# EasyEDA Pro project ZIAD_DBW_PROJECT_EDIT_9_MAY_2025.epro, board SteeringBoard4.4
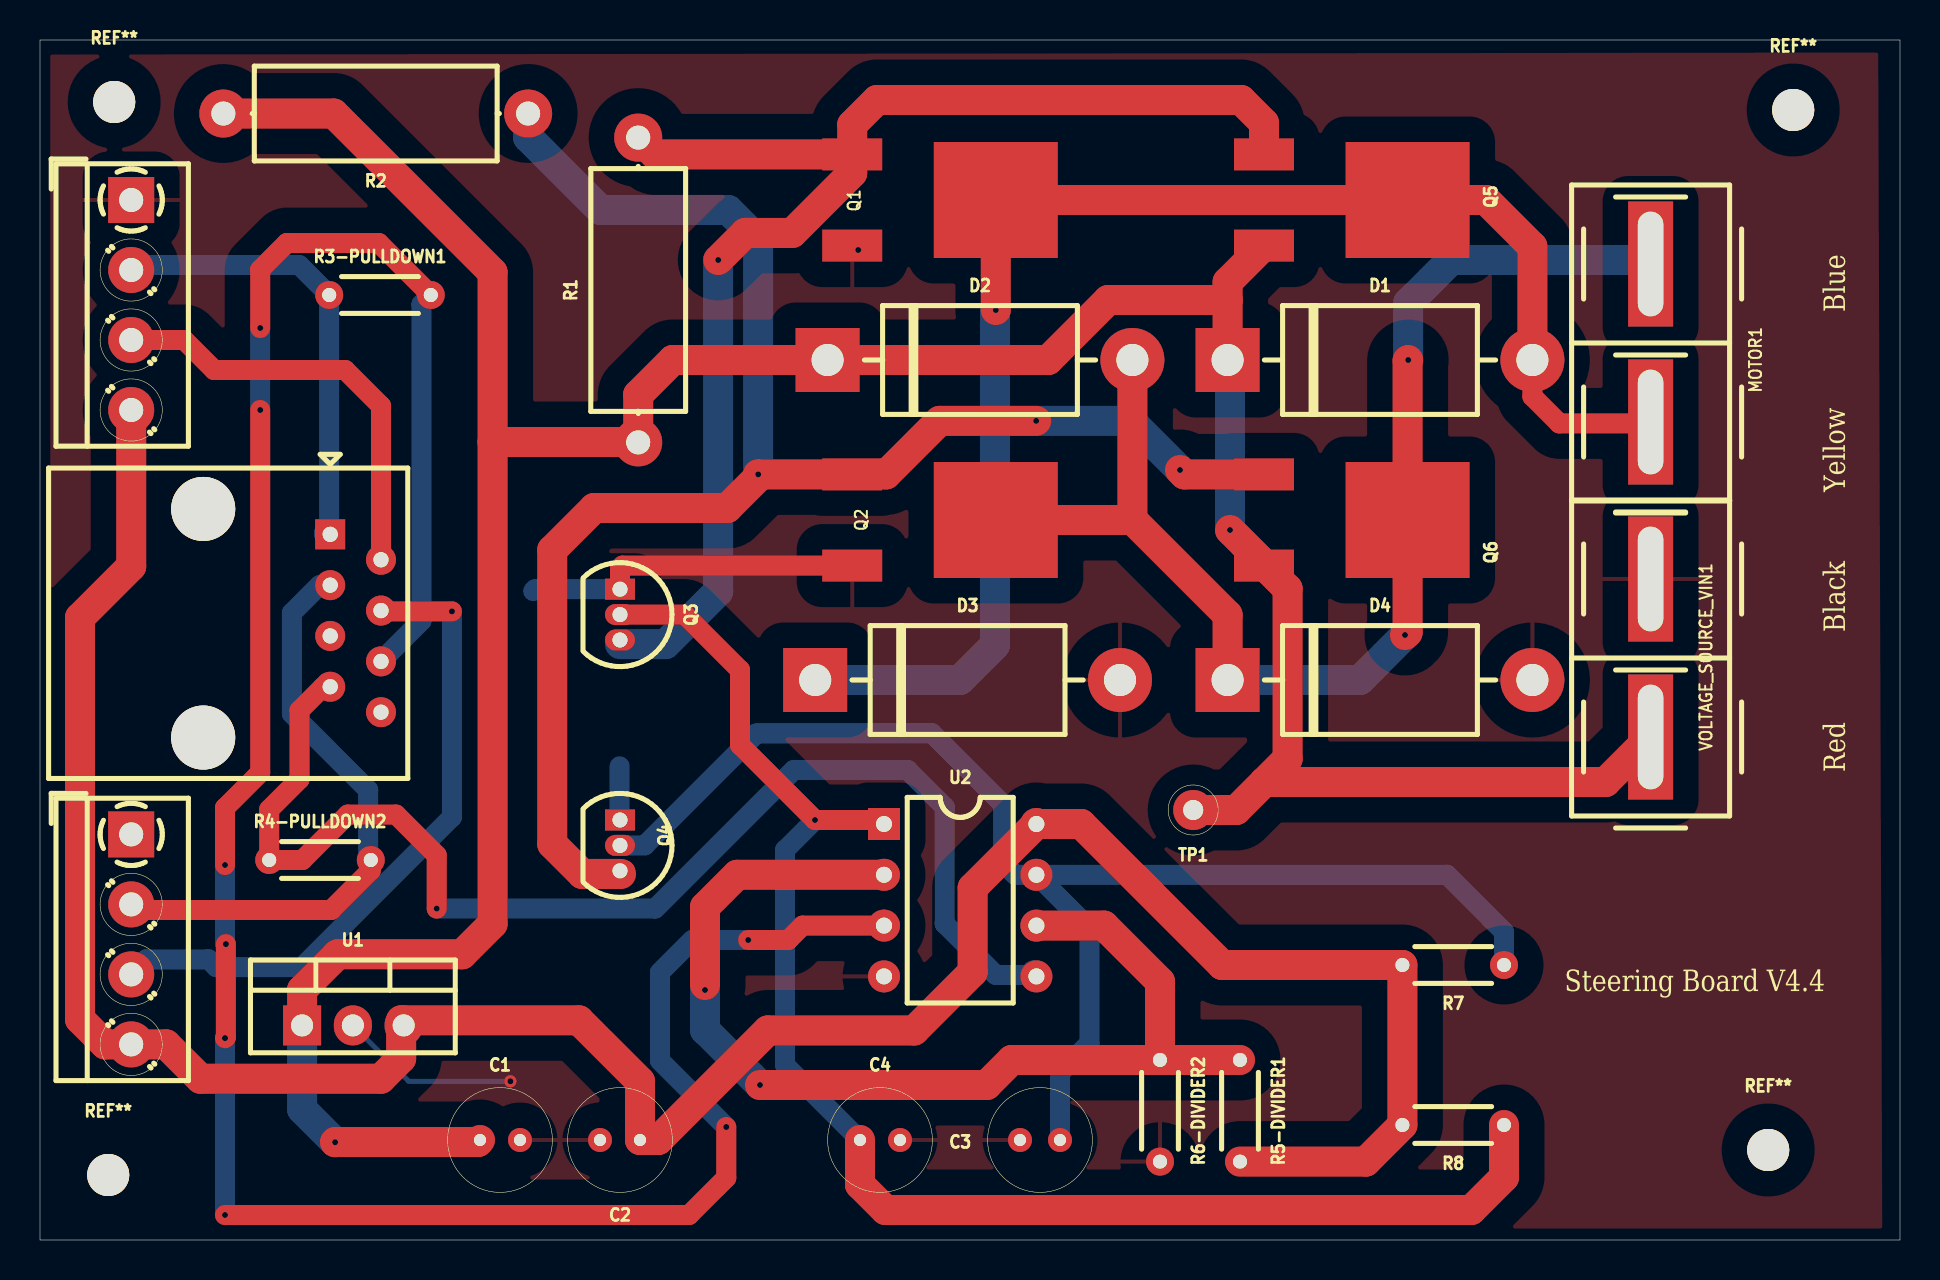
[diagram p9: board, top side]
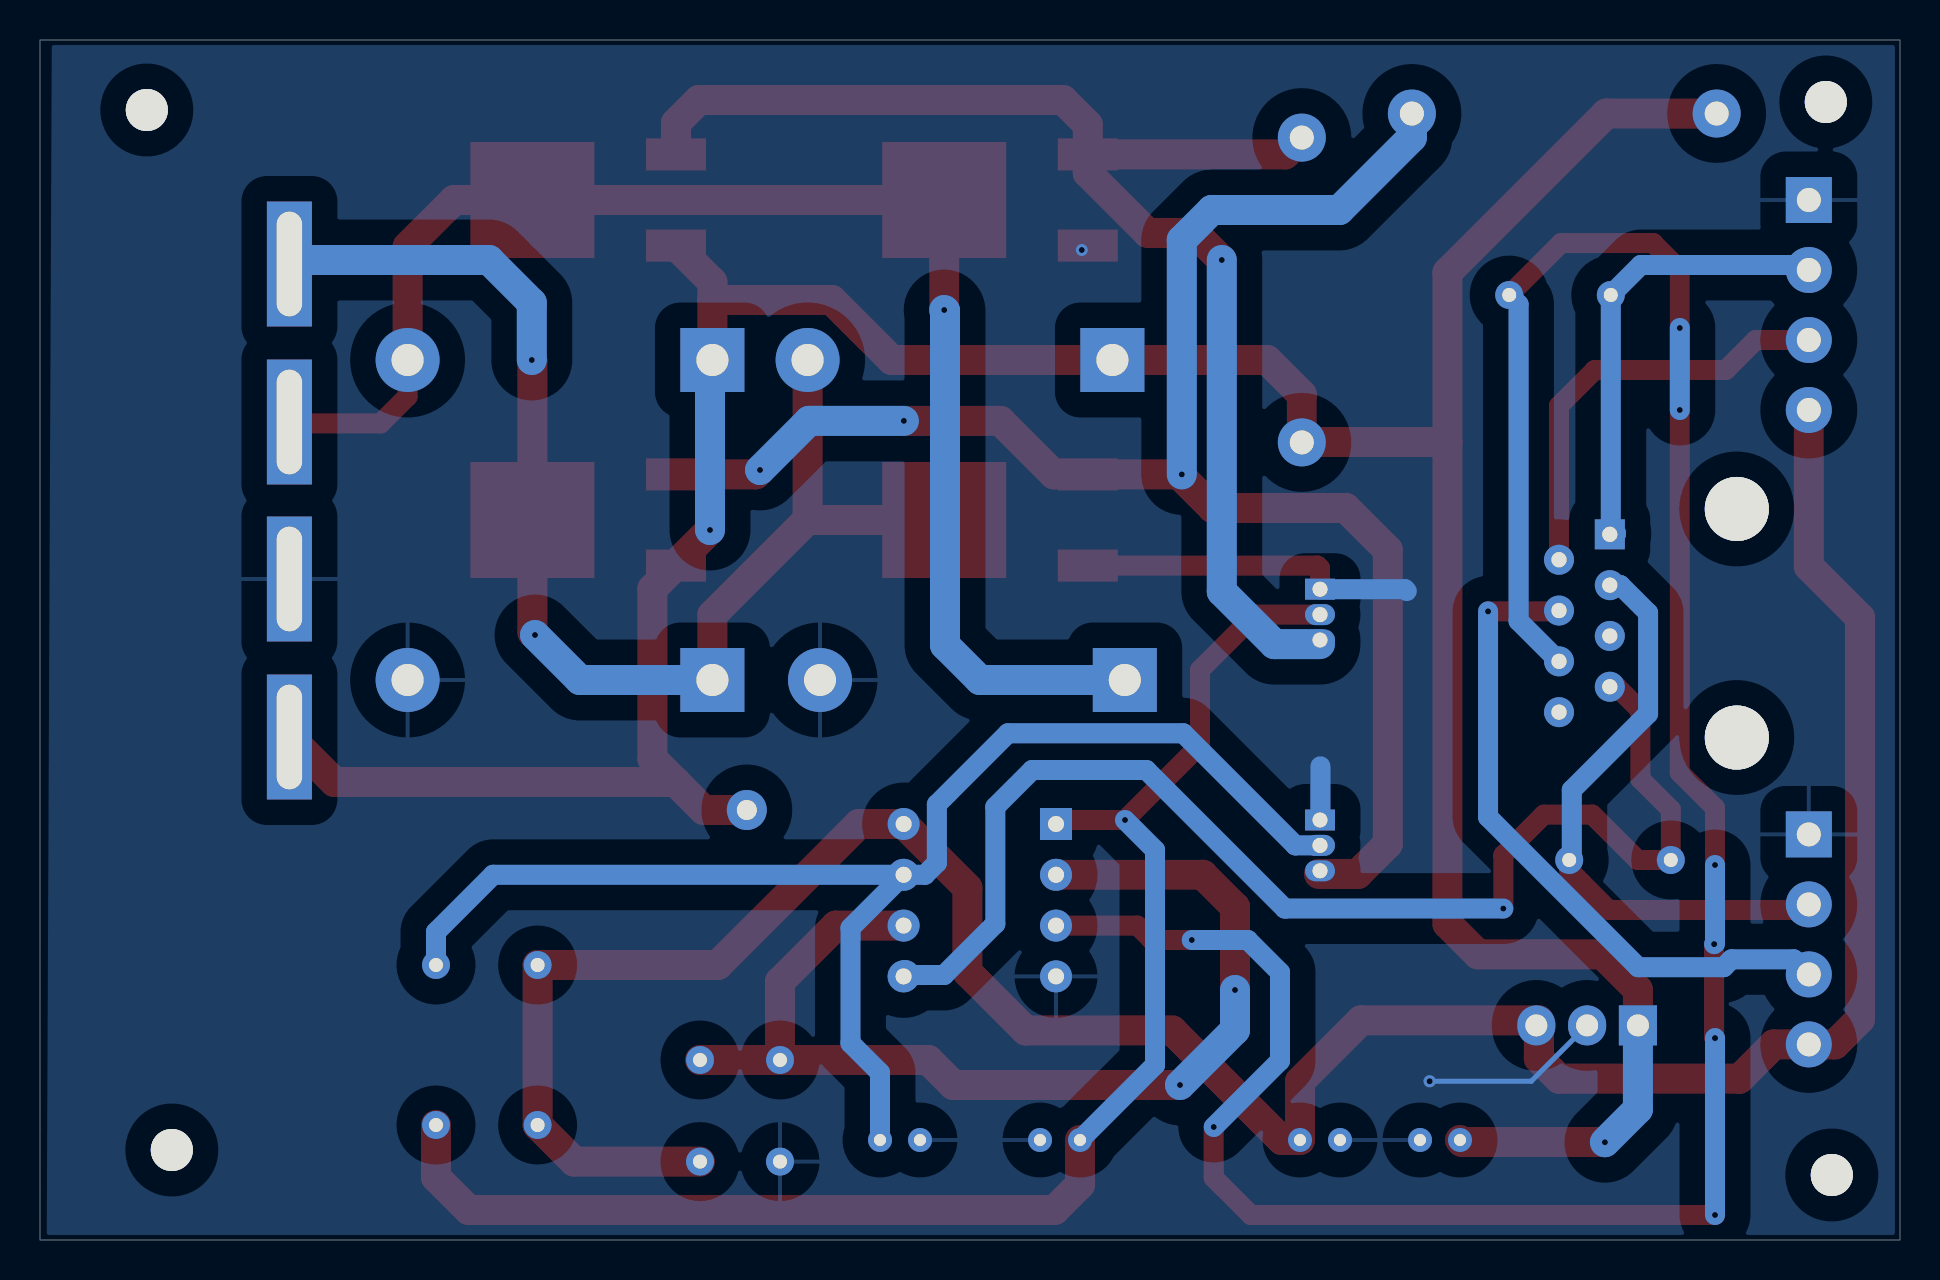
[diagram p10: board, bottom side, seen from below]

Outline 93 x 60 mm; copper layers: Top Layer, Bottom Layer. Coordinates in mm from the lower left corner of the outline.
Outline path: 0,60 93,60 93,0 0,0 0,60
Stack: Top Layer 0.035mm / Dielectric1 1.51mm FR4 er 4.5 / Bottom Layer 0.035mm

## Design rules (mm)
spacing safeClearance (default): track to track 0.152, other pairs 0.152 to 0.3
track width trackWidth (default): min 0.127, default 0.254, max 2.54
differential pair differentialPair (default): width min 0.127, default 0.254, max 2.54; gap min 0.152, default 0.152
via viaSize (default): diameter min 0.5, default 0.61, max 10; hole min 0.3, default 0.305, max 6
net GND uses CopperRegion1
pour ie568 uses CopperRegion1
pour ie567 uses CopperRegion1

## Placement (name value [footprint] x y rotation side)
C1  0.33uF  [Capacitor_THT:C_Radial_D5.0mm_H7.0mm_P2.00mm]  22 5 0 top
C2  0.1uF  [Capacitor_THT:C_Radial_D5.0mm_H7.0mm_P2.00mm]  30 5 180 top
C3  10pF  [Capacitor_THT:C_Radial_D5.0mm_H7.0mm_P2.00mm]  51 5 180 top
C4  10pF  [Capacitor_THT:C_Radial_D5.0mm_H7.0mm_P2.00mm]  41 5 0 top
D1  SB5H100-E3/73  [Diode_THT:D_DO-201AD_P15.24mm_Horizontal]  59.38 44 0 top
D2  SB5H100-E3/73  [Diode_THT:D_DO-201AD_P15.24mm_Horizontal]  39.38 44 0 top
D3  SB5H100-E3/73  [Diode_THT:D_DO-201AD_P15.24mm_Horizontal]  38.76 28 0 top
D4  SB5H100-E3/73  [Diode_THT:D_DO-201AD_P15.24mm_Horizontal]  59.38 28 0 top
LEFT1  Screw_Terminal_01x04  [TerminalBlock_MetzConnect:TerminalBlock_MetzConnect_Type059_RT06304HBWC_1x04_P3.50mm_Horizontal]  4.56 52 270 top
MOTOR1  Conn_01x02  [Anderson_Connector:Anderson_Conn]  86.74 44.85 90 top
Q1  AOD66406  [AOD66406:AOD66406]  39.92 52 270 top
Q2  AOD66406  [AOD66406:AOD66406]  39.92 36 270 top
Q3  2N7000  [Package_TO_SOT_THT:TO-92_Inline]  29 32.54 270 top
Q4  2N7000  [Package_TO_SOT_THT:TO-92_Inline]  29 21 270 top
Q5  AOD4189  [AOD4189:DPACK]  66 52 270 top
Q6  AOD4189  [AOD4189:DPACK]  66 36 270 top
R1  1K  [Resistor_THT:R_Axial_DIN0414_L11.9mm_D4.5mm_P15.24mm_Horizontal]  29.91 39.88 90 top
R2  1K  [Resistor_THT:R_Axial_DIN0414_L11.9mm_D4.5mm_P15.24mm_Horizontal]  24.41 56.32 180 top
R3-PULLDOWN1  10K  [Resistor_THT:R_Axial_DIN0204_L3.6mm_D1.6mm_P5.08mm_Horizontal]  14.46 47.25 0 top
R4-PULLDOWN2  10K  [Resistor_THT:R_Axial_DIN0204_L3.6mm_D1.6mm_P5.08mm_Horizontal]  11.46 19 0 top
R5-DIVIDER1  10K  [Resistor_THT:R_Axial_DIN0204_L3.6mm_D1.6mm_P5.08mm_Horizontal]  60 9 270 top
R6-DIVIDER2  4.7K  [Resistor_THT:R_Axial_DIN0204_L3.6mm_D1.6mm_P5.08mm_Horizontal]  56 9 270 top
R7  10k  [Resistor_THT:R_Axial_DIN0204_L3.6mm_D1.6mm_P5.08mm_Horizontal]  73.2 13.75 180 top
R8  10k  [Resistor_THT:R_Axial_DIN0204_L3.6mm_D1.6mm_P5.08mm_Horizontal]  73.2 5.75 180 top
REF**  -  [MountingHole:MountingHole_2.1mm]  3.41 3.25 0 top
REF**#2  -  [MountingHole:MountingHole_2.1mm]  3.71 56.9 0 top
REF**#3  -  [MountingHole:MountingHole_2.1mm]  87.66 56.5 0 top
REF**#4  -  [MountingHole:MountingHole_2.1mm]  86.41 4.5 0 top
RIGHT1  Screw_Terminal_01x04  [TerminalBlock_MetzConnect:TerminalBlock_MetzConnect_Type059_RT06304HBWC_1x04_P3.50mm_Horizontal]  4.56 20.28 270 top
RJ1  RJ45  [Connector_RJ:RJ45_Amphenol_54602-x08_Horizontal]  14.51 35.28 270 top
TP1  TestPoint  [Connector_Pin:Pin_D1.0mm_L10.0mm]  57.66 21.5 0 top
U1  L7805  [Package_TO_SOT_THT:TO-220-3_Vertical]  13.1 10.73 0 top
U2  LM393N  [Package_DIP:DIP-8_W7.62mm]  42.2 20.8 0 top
VOLTAGE_SOURCE_VIN1  Conn_01x02  [Anderson_Connector:Anderson_Conn]  86.74 29.1 90 top

## Footprints (pads in the part's own frame, mm; a bottom-side part is the same pattern mirrored in y, then rotated)
Anderson_Connector:Anderson_Conn
  rect 6.25x2.25 hole 5.23x1.27: 1(-3.95,6.21) 2(3.95,6.21)
AOD4189:DPACK
  rect 1.6x3 smd: 1(-2.28,-4.8) 3(2.28,-4.8)
  rect 5.8x6.2 smd: 4(0,2.38)
AOD66406:AOD66406
  rect 5.8x6.2 smd: 1(0,7.87)
  rect 1.6x3 smd: 2(-2.28,0.69) 3(2.28,0.69)
Capacitor_THT:C_Radial_D5.0mm_H7.0mm_P2.00mm
  round 1.2 hole 0.6: 1(0,0) 2(2,0)
Connector_Pin:Pin_D1.0mm_L10.0mm
  round 2 hole 1: 1(0,0)
Connector_RJ:RJ45_Amphenol_54602-x08_Horizontal
  rect 1.5x1.5 hole 0.76: 1(0,0)
  round 1.5 hole 0.76: 2(1.27,2.54) 3(2.54,0) 4(3.81,2.54) 5(5.08,0) 6(6.35,2.54) 7(7.62,0) 8(8.89,2.54)
  round 3.2 hole 3.2: 9(10.16,-6.35) 10(-1.27,-6.35)
Diode_THT:D_DO-201AD_P15.24mm_Horizontal
  rect 3.2x3.2 hole 1.6: 1(0,0)
  round 3.2 hole 1.6: 2(15.24,0)
MountingHole:MountingHole_2.1mm
  round 2.1 hole 2.1: 1(0,0)
Package_DIP:DIP-8_W7.62mm
  rect 1.6x1.6 hole 0.8: 1(0,0)
  round 1.6 hole 0.8: 2(0,-2.54) 3(0,-5.08) 4(0,-7.62) 5(7.62,-7.62) 6(7.62,-5.08) 7(7.62,-2.54) 8(7.62,0)
Package_TO_SOT_THT:TO-92_Inline
  rect 1.05x1.5 hole 0.75: 1(0,0)
  oval 1.05x1.5 hole 0.75: 2(1.27,0) 3(2.54,0)
Package_TO_SOT_THT:TO-220-3_Vertical
  rect 1.905x2 hole 1.1: 1(0,0)
  oval 1.905x2 hole 1.1: 2(2.54,0) 3(5.08,0)
Resistor_THT:R_Axial_DIN0204_L3.6mm_D1.6mm_P5.08mm_Horizontal
  round 1.4 hole 0.7: 1(0,0) 2(5.08,0)
Resistor_THT:R_Axial_DIN0414_L11.9mm_D4.5mm_P15.24mm_Horizontal
  round 2.4 hole 1.2: 1(0,0) 2(15.24,0)
TerminalBlock_MetzConnect:TerminalBlock_MetzConnect_Type059_RT06304HBWC_1x04_P3.50mm_Horizontal
  rect 2.3x2.3 hole 1.2: 1(0,0)
  round 2.3 hole 1.2: 2(3.5,0) 3(7,0) 4(10.5,0)

## Nets
GND: C1.2 C2.2 C3.2 C4.2 D3.2 D4.2 LEFT1.1 Q1.3 Q2.3 Q3.1 Q4.1 R6-DIVIDER2.2 RIGHT1.1 U1.2 U2.4 VOLTAGE_SOURCE_VIN1.2
1.8 VDC: R5-DIVIDER1.1 R6-DIVIDER2.1 U2.2 U2.6
5 VDC: C2.1 LEFT1.4 R5-DIVIDER1.2 R7.2 R8.2 RIGHT1.4 U1.3 U2.8
/L_RTN: LEFT1.2 R3-PULLDOWN1.1 RJ1.1
/L_SENSE: LEFT1.3 RJ1.2
/R_RTN: R4-PULLDOWN2.2 RIGHT1.2 RJ1.3
/R_SENSE: RIGHT1.3 RJ1.4
/R_TN: R3-PULLDOWN1.2 RJ1.6 U2.3
L_TN: R4-PULLDOWN2.1 RJ1.7 U2.5
LOAD_LEFT: D1.2 D3.1 MOTOR1.1 Q1.1 Q5.4
LOAD_RIGHT: D2.2 D4.1 MOTOR1.2 Q2.1 Q6.4
NET-(Q1-G): Q1.2 Q3.3 Q5.1 R1.2
NET-(Q2-G): Q2.2 Q4.3 Q6.1 R2.1
NET-(Q3-G): C4.1 Q3.2 R8.1 U2.1
NET-(Q4-G): C3.1 Q4.2 R7.1 U2.7
UNCONNECTED-(RJ1-PAD5): RJ1.5
UNCONNECTED-(RJ1-PAD8): RJ1.8
V_{SUPPLY}: C1.1 D1.1 D2.1 Q5.3 Q6.3 R1.1 R2.2 TP1.1 U1.1 VOLTAGE_SOURCE_VIN1.1

Pads without a net: REF** 1; REF**#2 1; REF**#3 1; REF**#4 1; RJ1 9 10

## Via types
v1: diameter 0.61, hole 0.305, Top Layer to Bottom Layer, 4 vias
v2: diameter 0.6, hole 0.3, Top Layer to Bottom Layer, 20 vias

## Routing (per net, layer and track width the routed paths; a pad name or vN(x,y) marks a point on that pad's centre or on a via; arc(x,y) is an arc through that point)
GND: length 28.8
  Top Layer w1: Q2.3 29.13,33.72 29,33.59 Q3.1
  Bottom Layer w0.254: U1.2 18.44,7.94 v1(23.52,7.94) ; 28.98,21.02 Q4.1
  Bottom Layer w1: 28.98,23.68 28.98,21.02 ; 24.66,32.45 24.75,32.54 Q3.1
  vias: v2(40.91,49.5)
1.8 VDC: length 55.2
  Top Layer w1.5: U2.2 34.86,18.26 33.25,16.65 33.25,12.75 ; R6-DIVIDER2.1 R5-DIVIDER1.1 ; R6-DIVIDER2.1 56,12.92 53.2,15.72 U2.6 ; R6-DIVIDER2.1 48.59,9 47.34,7.75 v2(36,7.75)
  Bottom Layer w1.5: v2(36,7.75) 33.25,10.5 v2(33.25,12.5)
5 VDC: length 134.2
  Top Layer w1.5: R5-DIVIDER1.2 66.29,3.92 R8.2 R7.2 59.11,13.75 52.06,20.8 U2.8 46.63,17.61 46.63,13.4 43.71,10.48 36.39,10.48 30.91,5 C2.1 30,7.93 26.95,10.98 18.06,10.98 18.06,9.08 17.04,8.06 8.02,8.06 6.31,9.78 RIGHT1.4 3.26,9.78 2,11.04 2,31.12 4.56,33.68 LEFT1.4
/L_RTN: length 22.6
  Bottom Layer w1: 14.46,35.33 R3-PULLDOWN1.1 12.96,48.75 4.81,48.75 LEFT1.2
  Bottom Layer w1.5: 14.48,35.31 14.46,35.33 14.46,35.31
/L_SENSE: length 21.5
  Top Layer w1: LEFT1.3 7.21,45 8.71,43.5 15.26,43.5 17.05,41.71 RJ1.2
/R_RTN: length 29.9
  Top Layer w1: 4.84,16.5 14.56,16.5 16.54,18.48 R4-PULLDOWN2.2
  Top Layer w1.5: 4.84,16.5 RIGHT1.2
  Bottom Layer w1: R4-PULLDOWN2.2 16.41,19.13 16.41,22.5 12.6,26.31 12.6,31.36 13.98,32.74 RJ1.3
/R_SENSE: length 33.5
  Top Layer w1: RJ1.4 17.09,31.43 v1(20.6,31.43)
  Bottom Layer w1: v1(20.6,31.43) 20.6,21.14 13.09,13.64 8.82,13.64 8.42,14.03 5.31,14.03 RIGHT1.3
/R_TN: length 127.2
  Top Layer w1: v2(9.25,18.75) 9.25,21.61 11.01,23.37 v2(11.01,41.5) ; v2(35.41,15) 37.41,15 38.13,15.72 U2.3 ; v2(34.31,5.65) 34.31,3.11 32.45,1.25 v2(9.25,1.25)
  Top Layer w1.001: v1(9.25,10.09) 9.29,10.14 v1(9.29,14.79) ; v2(11.01,45.6) 11.01,48.51 12.34,49.85 16.94,49.85 R3-PULLDOWN1.2
  Bottom Layer w1: v2(35.41,15) 32.61,15 31,13.39 31,8.96 v2(34.31,5.65) ; v2(11.01,41.5) v2(11.01,45.6)
  Bottom Layer w1.001: RJ1.6 19.07,30.96 19.07,46.78 R3-PULLDOWN1.2 ; v1(9.25,10.09) v2(9.25,1.25) ; v1(9.29,14.79) 9.25,14.84 v2(9.25,18.75)
L_TN: length 63.5
  Top Layer w1: v2(19.83,16.57) 19.83,19.24 17.8,21.27 15.39,21.27 13.12,19 R4-PULLDOWN2.1 11.46,21.53 12.98,23.04 12.98,26.48 14.16,27.66 RJ1.7
  Bottom Layer w1: 49.75,13.25 47.79,13.25 45.23,15.81 45.23,21.65 43.39,23.5 37.69,23.5 30.76,16.57 v2(19.83,16.57)
  Bottom Layer w1.5: 49.75,13.25 U2.5
LOAD_LEFT: length 73.8
  Top Layer w1: D1.2 74.62,42.18 75.97,40.83 80.46,40.83 MOTOR1.1
  Top Layer w1.5: v2(47.79,46.5) Q1.1 Q5.4 72.29,52 74.62,49.67 D1.2
  Bottom Layer w1.5: D3.1 46,28 47.75,29.75 47.75,46.46 v2(47.79,46.5)
LOAD_RIGHT: length 64.4
  Top Layer w1.5: v2(68.25,30.25) 68.38,30.38 Q6.4 68.38,43.97 v2(68.41,44) ; D2.2 54.62,36.01 54.63,36 ; Q2.1 54.63,36 ; 54.63,36 59.38,31.25 D4.1
  Bottom Layer w1.5: MOTOR1.2 80.33,49 70.55,49 68.41,46.86 v2(68.41,44) ; v2(68.25,30.25) 66,28 D4.1
NET-(Q1-G): length 67.7
  Top Layer w1.5: Q5.1 61.2,55.85 60.05,57 41.85,57 40.61,55.76 Q1.2 ; Q1.2 30.75,54.28 R1.2 ; Q1.2 40.61,53.35 37.62,50.35 35.26,50.35 v2(33.91,49)
  Bottom Layer w1.5: 29,29.8 31.28,29.8 33.91,32.42 v2(33.91,49)
NET-(Q2-G): length 84.8
  Top Layer w1.5: v2(57,38.5) 57.22,38.28 Q6.1 ; 29.05,18.3 27.11,18.3 25.61,19.8 25.61,34.5 27.71,36.6 34.37,36.6 35.91,38.14 v2(35.91,38.28) Q2.2 42.31,38.28 44.98,40.96 v2(49.81,40.96)
  Bottom Layer w1.5: v2(49.81,40.96) 54.54,40.96 v2(57,38.5) ; v2(35.91,38.28) 35.91,50 34.41,51.5 28.03,51.5 24.41,55.12 R2.1
NET-(Q3-G): length 76.2
  Top Layer w1: U2.1 42,21 v2(38.75,21) 35,24.75 35,28.5 32.23,31.27 Q3.2
  Top Layer w1.5: C4.1 41,2.77 42.27,1.5 71.56,1.5 73.2,3.13 R8.1
  Bottom Layer w1: v2(38.75,21) 37.25,19.5 37.25,8.75 C4.1
NET-(Q4-G): length 69
  Bottom Layer w1.001: U2.7 70.34,18.26 73.2,15.4 R7.1 ; U2.7 52.47,15.61 52.47,9.84 51,8.37 C3.1 ; U2.7 48.75,18.26 48.16,18.86 48.16,21.78 44.6,25.33 35.84,25.33 30.23,19.73 Q4.2
V_{SUPPLY}: length 170.6
  Top Layer w1.5: 61.21,33.73 62.38,32.56 62.38,24.06 61.21,22.9 ; 61.21,33.73 Q6.3 ; 61.21,33.73 61.21,33.79 v2(59.5,35.5) ; C1.1 21.9,4.9 14.77,4.9 v2(14.75,4.89) ; 9.17,56.32 14.69,56.32 22.63,48.38 22.63,39.9 ; VOLTAGE_SOURCE_VIN1.1 78.28,22.9 61.21,22.9 ; 29.91,39.9 29.91,42.27 31.64,44 D2.1 50.41,44 53.41,47 59.38,47 ; 29.91,39.9 R1.1 ; 29.91,39.9 22.63,39.9 ; Q5.3 59.38,47.9 59.38,47 ; 22.63,39.9 22.63,15.81 21.1,14.29 14.88,14.29 13.1,12.51 U1.1 ; 61.21,22.9 59.81,21.5 TP1.1 ; 59.38,47 D1.1
  Bottom Layer w1.5: v2(59.5,35.5) 59.5,43.88 D1.1 ; v2(14.75,4.89) 13.1,6.54 U1.1

## Copper pours and planes (outline as drawn; the poured copper is in the pictures)
GND on Top Layer: 0.51,59.27 0.51,0.57 92.11,0.57 91.91,59.37
GND on Bottom Layer: 0.16,59.75 0.16,0.25 92.66,0.25 92.41,59.75

## Text on the board
Component Marking Layer: Conn_01x02
Top Silkscreen Layer: Steering Board V4.4 | Blue | Yellow | Black | Red
